# Altium schematic sheet Punto2.SchDoc
size A4
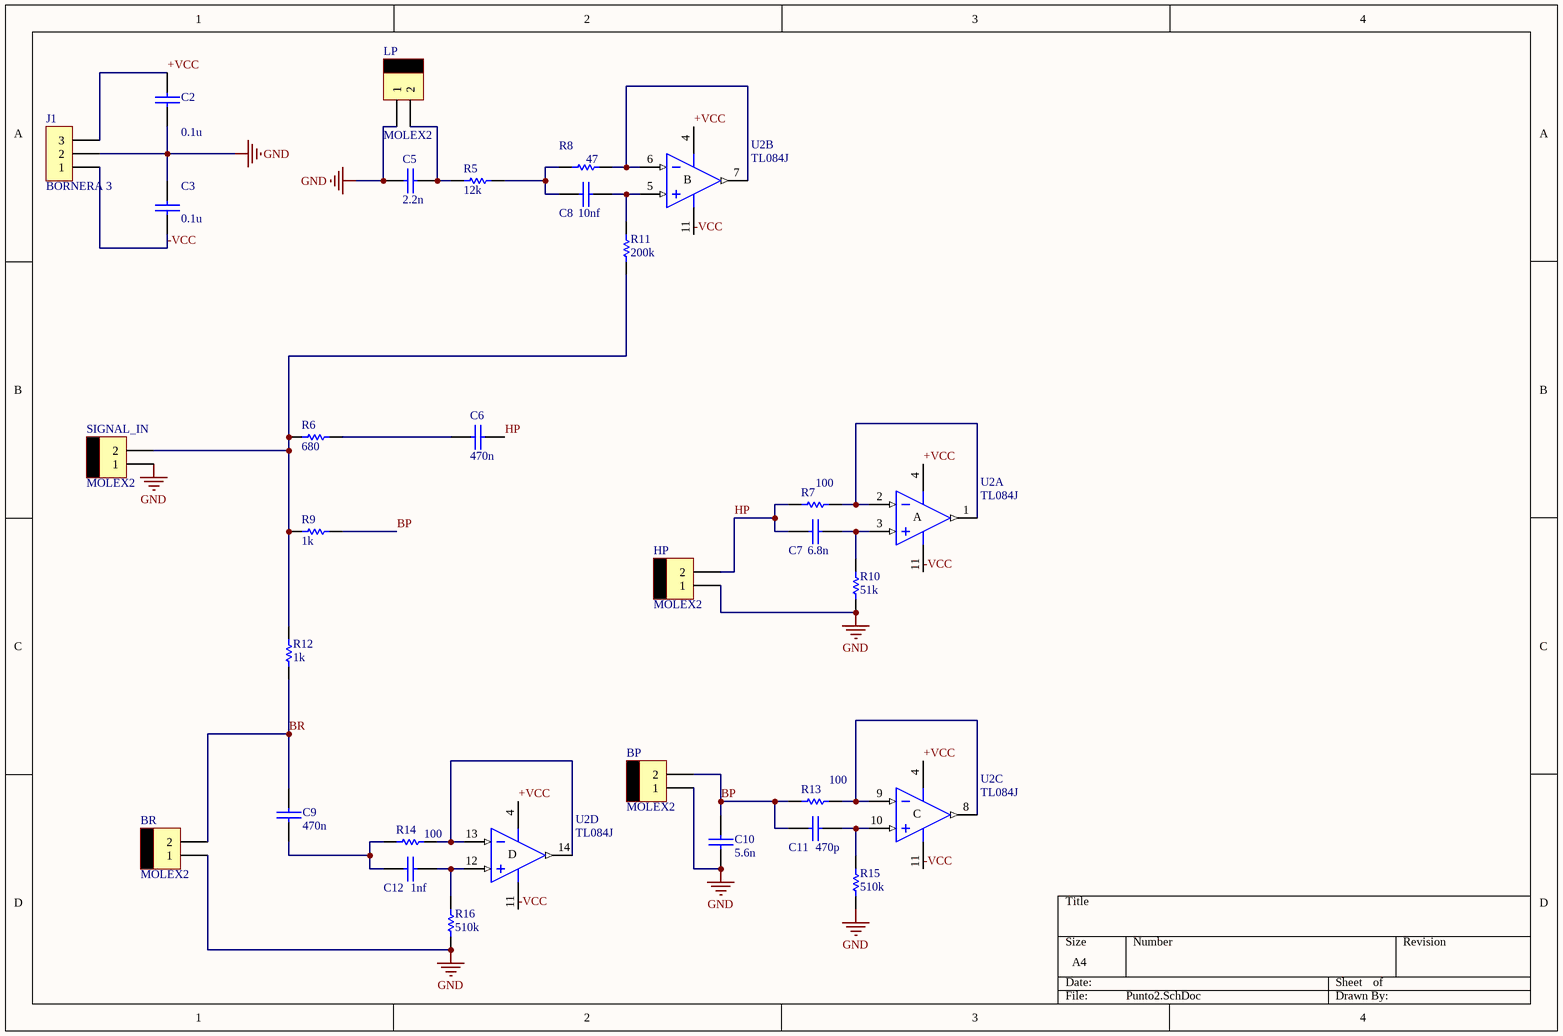
[diagram p0: Punto2.SchDoc]

## Parts
BP  MOLEX2  [MOLEX2]
BR  MOLEX2  [MOLEX2]
C2  0.1u  [CAP200]
C3  0.1u  [CAP200]
C5  2.2n  [0805]
C6  470n  [0805]
C7  6.8n  [0805]
C8  10nf  [0805]
C9  470n  [0805]
C10  5.6n  [0805]
C11  470p  [0805]
C12  1nf  [0805]
HP  MOLEX2  [MOLEX2]
J1  BORNERA 3  [BORNERA3]
LP  MOLEX2  [MOLEX2]
R5  12k  [0805]
R6  680  [0805]
R7  100  [0805]
R8  47  [0805]
R9  1k  [0805]
R10  51k  [0805]
R11  200k  [0805]
R12  1k  [0805]
R13  100  [0805]
R14  100  [0805]
R15  510k  [0805]
R16  510k  [0805]
SIGNAL_IN  MOLEX2  [MOLEX2]
U2  TL084J  [J014]  (parts A,B,C,D of 4)

## Nets
GND: BP.1 BR.1 C2.2 C3.1 C5.2 C10.2 HP.1 J1.2 LP.1 R10.1 R15.1 R16.1 SIGNAL_IN.1
+VCC: C2.1 J1.3 U2.4(V+)
-VCC: C3.2 J1.1 U2.11(V-)
BP: BP.2 C10.1 C11.1 R9.2 R13.1
BR: BR.2 C9.2 R12.2
HP: C6.2 C7.1 HP.2 R7.1
NetC5_1: C5.1 LP.2 R5.1
NetC6_1: C6.1 R6.2
NetC7_2: C7.2 R10.2 U2.3(IN+)
NetC8_1: C8.1 R5.2 R8.1
NetC8_2: C8.2 R11.2 U2.5(IN+)
NetC9_1: C9.1 C12.1 R14.1
NetC11_2: C11.2 R15.2 U2.10(IN+)
NetC12_2: C12.2 R16.2 U2.12(IN+)
NetR6_1: R6.1 R9.1 R11.1 R12.1 SIGNAL_IN.2
NetR7_2: R7.2 U2.1(OUT) U2.2(IN-)
NetR8_2: R8.2 U2.6(IN-) U2.7(OUT)
NetR13_2: R13.2 U2.8(OUT) U2.9(IN-)
NetR14_2: R14.2 U2.13(IN-) U2.14(OUT)

## Notes on the sheet
- (in symbol TL084J, part A) A
- (in symbol TL084J, part B) B
- (in symbol TL084J, part C) C
- (in symbol TL084J, part D) D

## Library data of the parts
C2 C3 C5-C12 = CAP
R5-R16 = RES
U2 = TL084J: JFET-Input Operational Amplifier; Published: 16-Jan-2001; LatestRevisionDate: 04-Mar-2005; LatestRevisionNote: Stylized 3D Model Added.; DatasheetVersion: Feb-1999; PackageVersion: Jun-1999; PackageReference: J014; Publisher: Altium Limited; PackageDescription: DIP; 14 Leads; Row Spacing 7.62 mm; Pitch 2.54 mm; ComponentLink1Description: Manufacturer Link; ComponentLink1URL: http://www.ti.com/; ComponentLink2Description: Datasheet; ComponentLink2URL: http://www-s.ti.com/sc/ds/tl084.pdf